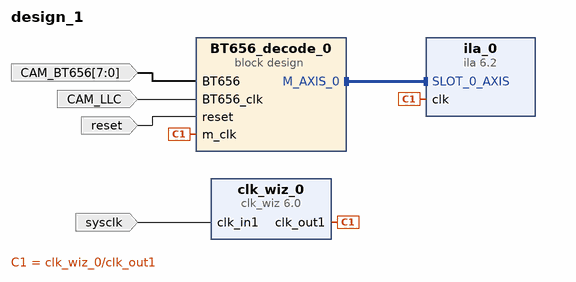
[diagram p0: block diagram of the top level]
# Vivado block design design_1, xc7z020clg400-1, Vivado 2021.2
create_bd_design design_1

create_bd_port -dir I -from 7 -to 0 CAM_BT656
create_bd_port -dir I reset
create_bd_port -dir I -type clk sysclk
set_property -dict {CONFIG.FREQ_HZ 100000000} [get_bd_ports sysclk]
create_bd_port -dir I CAM_LLC

create_bd_cell -type ip -vlnv xilinx.com:ip:clk_wiz:6.0 clk_wiz_0
set_property -dict [list \
  CONFIG.CLKIN2_JITTER_PS 134.99 \
  CONFIG.CLKOUT1_JITTER 430.966 \
  CONFIG.CLKOUT1_PHASE_ERROR 431.189 \
  CONFIG.CLKOUT1_REQUESTED_OUT_FREQ 11.33 \
  CONFIG.CLK_IN1_BOARD_INTERFACE sys_clock \
  CONFIG.MMCM_CLKFBOUT_MULT_F 57.375 \
  CONFIG.MMCM_CLKIN2_PERIOD 10.000 \
  CONFIG.MMCM_CLKOUT0_DIVIDE_F 79.125 \
  CONFIG.MMCM_DIVCLK_DIVIDE 8 \
  CONFIG.SECONDARY_IN_FREQ 100.000 \
  CONFIG.SECONDARY_SOURCE Single_ended_clock_capable_pin \
  CONFIG.USE_BOARD_FLOW true \
  CONFIG.USE_INCLK_SWITCHOVER false \
  CONFIG.USE_LOCKED false \
  CONFIG.USE_RESET false \
] [get_bd_cells clk_wiz_0]
create_bd_cell -type ip -vlnv xilinx.com:ip:ila:6.2 ila_0
set_property -dict [list \
  CONFIG.ALL_PROBE_SAME_MU true \
  CONFIG.ALL_PROBE_SAME_MU_CNT 1 \
  CONFIG.C_ADV_TRIGGER false \
  CONFIG.C_DATA_DEPTH 131072 \
  CONFIG.C_ENABLE_ILA_AXI_MON true \
  CONFIG.C_EN_STRG_QUAL 0 \
  CONFIG.C_MONITOR_TYPE AXI \
  CONFIG.C_NUM_OF_PROBES 9 \
  CONFIG.C_PROBE0_MU_CNT 1 \
  CONFIG.C_PROBE0_WIDTH 1 \
  CONFIG.C_PROBE1_MU_CNT 1 \
  CONFIG.C_PROBE2_MU_CNT 1 \
  CONFIG.C_PROBE3_MU_CNT 1 \
  CONFIG.C_PROBE4_MU_CNT 1 \
  CONFIG.C_PROBE4_WIDTH 1 \
  CONFIG.C_PROBE5_MU_CNT 1 \
  CONFIG.C_PROBE6_MU_CNT 1 \
  CONFIG.C_PROBE7_MU_CNT 1 \
  CONFIG.C_PROBE7_WIDTH 1 \
  CONFIG.C_PROBE8_MU_CNT 1 \
  CONFIG.C_SLOT_0_AXI_PROTOCOL AXI4S \
  CONFIG.C_TRIGIN_EN false \
  CONFIG.C_TRIGOUT_EN false \
] [get_bd_cells ila_0]
create_bd_cell -type container -reference BT656_decode BT656_decode_0
set_property -dict [list \
  CONFIG.ACTIVE_SIM_BD BT656_decode.bd \
  CONFIG.ACTIVE_SYNTH_BD BT656_decode.bd \
  CONFIG.ENABLE_DFX 0 \
  CONFIG.LIST_SIM_BD BT656_decode.bd \
  CONFIG.LIST_SYNTH_BD BT656_decode.bd \
  CONFIG.LOCK_PROPAGATE 0 \
] [get_bd_cells BT656_decode_0]

# ---- connections ----

connect_bd_intf_net [get_bd_intf_pins BT656_decode_0/M_AXIS_0] [get_bd_intf_pins ila_0/SLOT_0_AXIS]
connect_bd_net -net CAM_BT656_1 [get_bd_ports CAM_BT656] [get_bd_pins BT656_decode_0/BT656]
connect_bd_net [get_bd_ports CAM_LLC] [get_bd_pins BT656_decode_0/BT656_clk]
connect_bd_net -net clk_in1_0_1 [get_bd_ports sysclk] [get_bd_pins clk_wiz_0/clk_in1]
connect_bd_net [get_bd_pins clk_wiz_0/clk_out1] [get_bd_pins ila_0/clk] [get_bd_pins BT656_decode_0/m_clk]
connect_bd_net [get_bd_ports reset] [get_bd_pins BT656_decode_0/reset]

validate_bd_design
save_bd_design
